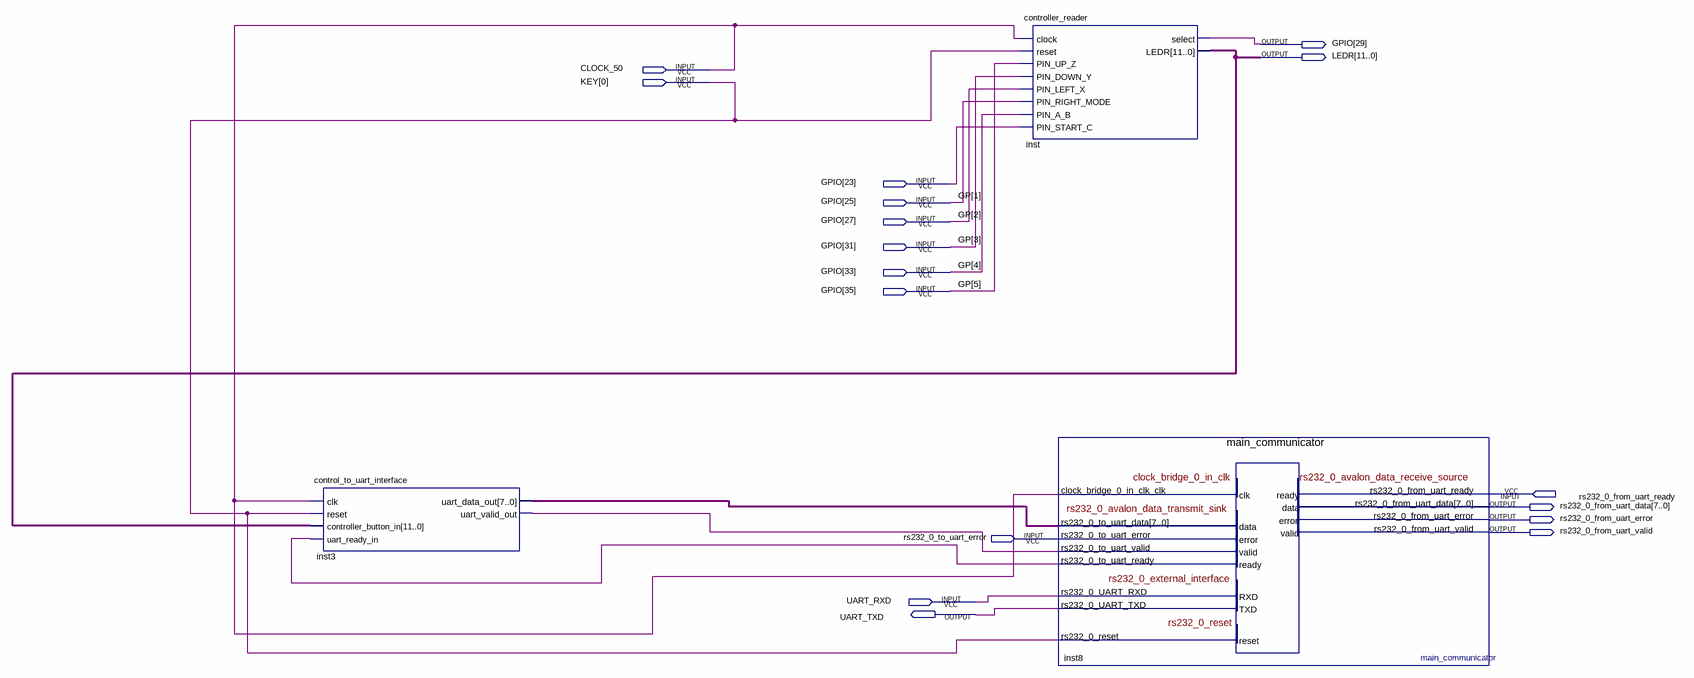
[diagram p0: schematic sheet]
// Quartus schematic AAAAAAAAAA.bdf as structural Verilog: 3 symbols, 17 pins
module AAAAAAAAAA (
  input  CLOCK_50,
  input  [0:0] KEY,
  inout  [35:23] GPIO,
  input  rs232_0_from_uart_ready,
  input  rs232_0_to_uart_error,
  input  UART_RXD,
  output [11:0] LEDR,
  output [7:0] rs232_0_from_uart_data,
  output rs232_0_from_uart_error,
  output rs232_0_from_uart_valid,
  output UART_TXD
);

  wire inst3_uart_valid_out, inst8_rs232_0_to_uart_ready;
  wire [7:0] inst3_uart_data_out;

  control_to_uart_interface inst3 (
    .clk(CLOCK_50), .reset(KEY[0]), .controller_button_in(LEDR), .uart_ready_in(inst8_rs232_0_to_uart_ready),
    .uart_data_out(inst3_uart_data_out), .uart_valid_out(inst3_uart_valid_out));
  controller_reader inst (
    .clock(CLOCK_50), .reset(KEY[0]), .PIN_UP_Z(GPIO[35]), .PIN_DOWN_Y(GPIO[31]), .PIN_LEFT_X(GPIO[27]),
    .PIN_RIGHT_MODE(GPIO[25]), .PIN_A_B(GPIO[33]), .PIN_START_C(GPIO[23]), .select(GPIO[29]), .LEDR(LEDR));
  main_communicator inst8 (
    .clock_bridge_0_in_clk_clk(CLOCK_50), .rs232_0_from_uart_ready(rs232_0_from_uart_ready),
    .rs232_0_to_uart_data(inst3_uart_data_out), .rs232_0_to_uart_error(rs232_0_to_uart_error),
    .rs232_0_to_uart_valid(inst3_uart_valid_out), .rs232_0_UART_RXD(UART_RXD), .rs232_0_reset(KEY[0]),
    .rs232_0_from_uart_data(rs232_0_from_uart_data), .rs232_0_from_uart_error(rs232_0_from_uart_error),
    .rs232_0_from_uart_valid(rs232_0_from_uart_valid), .rs232_0_to_uart_ready(inst8_rs232_0_to_uart_ready),
    .rs232_0_UART_TXD(UART_TXD));

  // Other names for the same wires on the sheet: GP[5:1] = {GPIO[35], GPIO[33], GPIO[31], GPIO[27], GPIO[25]}
endmodule
